# Altium schematic sheet Power_Switch.SchDoc: Dahlia Carrier Board
size A3; Organization: Toradex AG; Address1: Ebenaustrasse 10; Address2: Horw; Address3: 6048; Address4: Switzerland; DocumentNumber: 4; Revision: V1.1; SheetNumber: 4; SheetTotal: 21; PageSetup: Record=PageOptions|CenterHorizontal=True|CenterVertical=True|PrintScale=0.71|XCorrection=1.00|YCorrection=1.00|PrintKind=1|BorderSize=5000000|LeftOffset=0|BottomOffset=0|Orientation=2|PaperLength=1000|PaperWidth=1000|Scale=100|PaperSource=15|PrintQuality=600|MediaType=1|DitherType=10|PaperKind=A4|PrintScaleMode=1
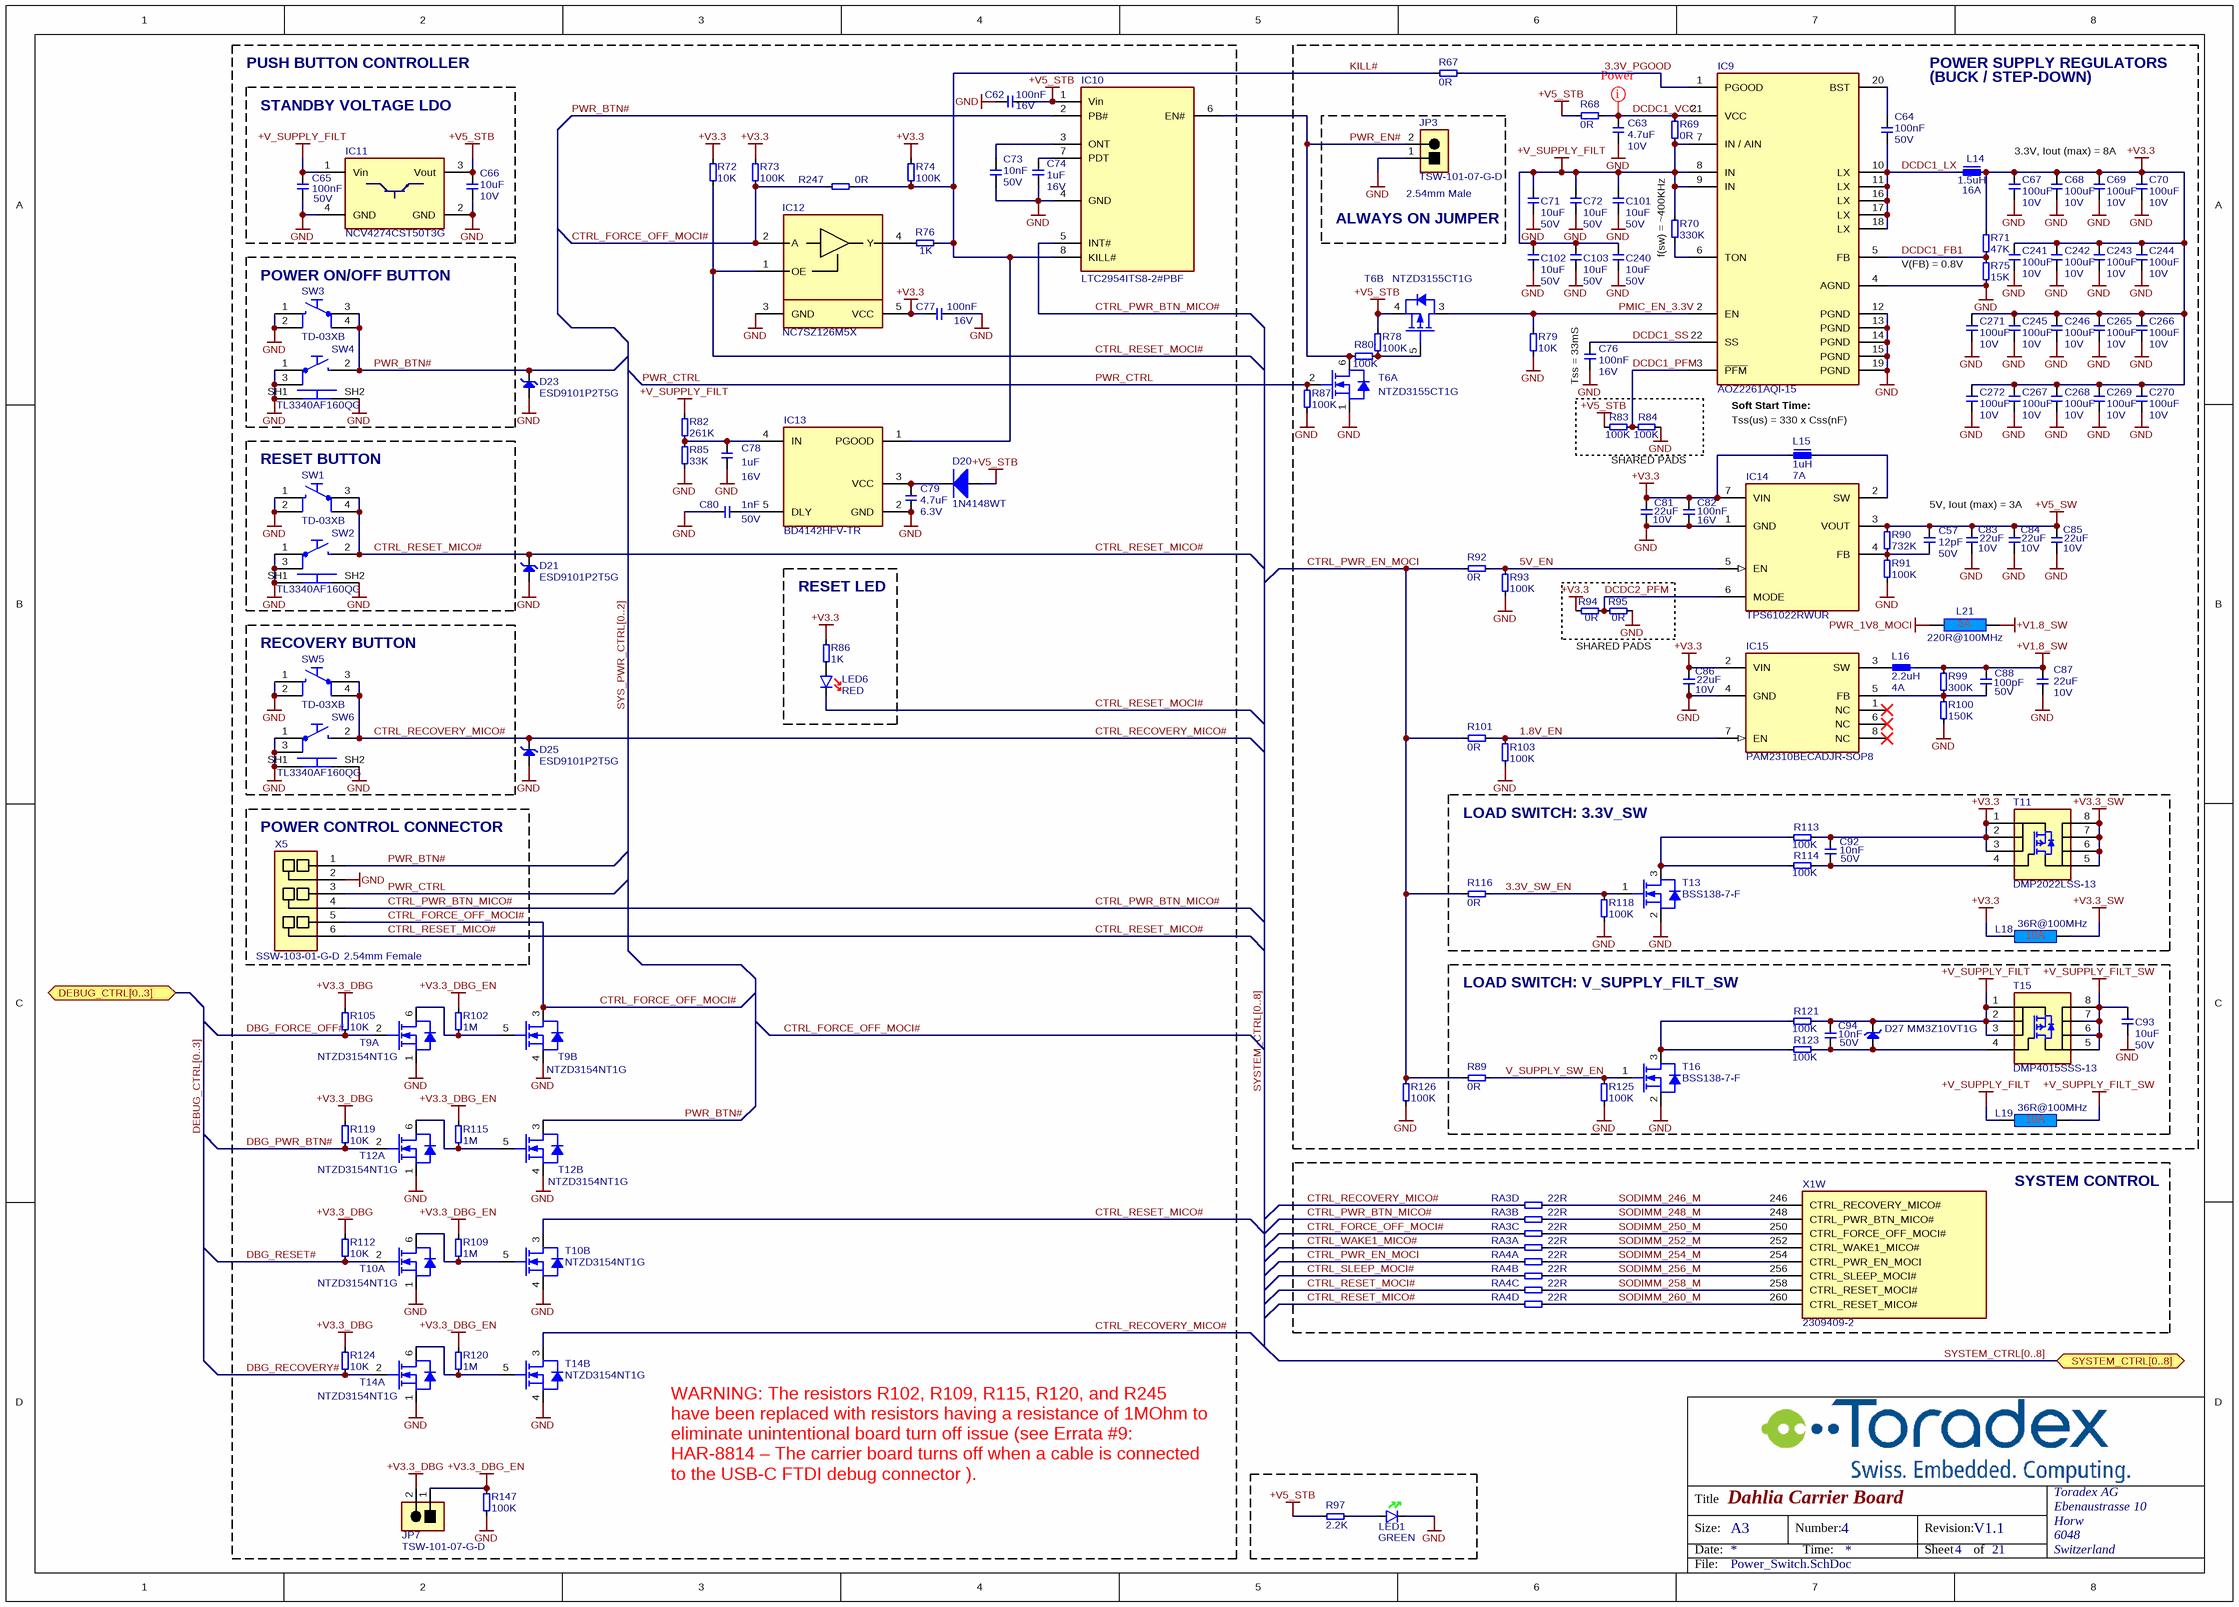
[diagram p0: Power_Switch.SchDoc]

## Parts
C57  Rating: 50V  [CAPC1005X60N]  (hidden comment: 12pF)
C62  Rating: 16V  [CAPC1005X60N]  (hidden comment: 100nF)
C63  Rating: 10V  [T_CAPC0603X33N]  (hidden comment: 4.7uF)
C64  Rating: 50V  [CAPC1005X60N]  (hidden comment: 100nF)
C65  Rating: 50V  [CAPC1005X60N]  (hidden comment: 100nF)
C66  Rating: 10V  [T_CAPC0603X33N]  (hidden comment: 10uF)
C67  Rating: 10V  [T_CAPC1206X60N]  (hidden comment: 100uF)
C68  Rating: 10V  [T_CAPC1206X60N]  (hidden comment: 100uF)
C69  Rating: 10V  [T_CAPC1206X60N]  (hidden comment: 100uF)
C70  Rating: 10V  [T_CAPC1206X60N]  (hidden comment: 100uF)
C71  Rating: 50V  [T_CAPC1206X60N]  (hidden comment: 10uF)
C72  Rating: 50V  [T_CAPC1206X60N]  (hidden comment: 10uF)
C73  Rating: 50V  [CAPC1005X60N]  (hidden comment: 10nF)
C74  Rating: 16V  [CAPC1005X60N]  (hidden comment: 1uF)
C76  Rating: 16V  [CAPC1005X60N]  (hidden comment: 100nF)
C77  Rating: 16V  [CAPC1005X60N]  (hidden comment: 100nF)
C78  Rating: 16V  [CAPC1005X60N]  (hidden comment: 1uF)
C79  Rating: 6.3V  [CAPC1005X60N]  (hidden comment: 4.7uF)
C80  Rating: 50V  [CAPC1005X60N]  (hidden comment: 1nF)
C81  Rating: 10V  [T_CAPC0805X125N]  (hidden comment: 22uF)
C82  Rating: 16V  [CAPC1005X60N]  (hidden comment: 100nF)
C83  Rating: 10V  [T_CAPC0805X125N]  (hidden comment: 22uF)
C84  Rating: 10V  [T_CAPC0805X125N]  (hidden comment: 22uF)
C85  Rating: 10V  [T_CAPC0805X125N]  (hidden comment: 22uF)
C86  Rating: 10V  [T_CAPC0805X125N]  (hidden comment: 22uF)
C87  Rating: 10V  [T_CAPC0805X125N]  (hidden comment: 22uF)
C88  Rating: 50V  [CAPC1005X60N]  (hidden comment: 100pF)
C92  Rating: 50V  [CAPC1005X60N]  (hidden comment: 10nF)
C93  Rating: 50V  [T_CAPC1206X60N]  (hidden comment: 10uF)
C94  Rating: 50V  [CAPC1005X60N]  (hidden comment: 10nF)
C101  Rating: 50V  [T_CAPC1206X60N]  (hidden comment: 10uF)
C102  Rating: 50V  [T_CAPC1206X60N]  (hidden comment: 10uF)
C103  Rating: 50V  [T_CAPC1206X60N]  (hidden comment: 10uF)
C240  Rating: 50V  [T_CAPC1206X60N]  (hidden comment: 10uF)
C241  Rating: 10V  [T_CAPC1206X60N]  (hidden comment: 100uF)
C242  Rating: 10V  [T_CAPC1206X60N]  (hidden comment: 100uF)
C243  Rating: 10V  [T_CAPC1206X60N]  (hidden comment: 100uF)
C244  Rating: 10V  [T_CAPC1206X60N]  (hidden comment: 100uF)
C245  Rating: 10V  [T_CAPC1206X60N]  (hidden comment: 100uF)
C246  Rating: 10V  [T_CAPC1206X60N]  (hidden comment: 100uF)
C265  Rating: 10V  [T_CAPC1206X60N]  (hidden comment: 100uF)
C266  Rating: 10V  [T_CAPC1206X60N]  (hidden comment: 100uF)
C267  Rating: 10V  [T_CAPC1206X60N]  (hidden comment: 100uF)
C268  Rating: 10V  [T_CAPC1206X60N]  (hidden comment: 100uF)
C269  Rating: 10V  [T_CAPC1206X60N]  (hidden comment: 100uF)
C270  Rating: 10V  [T_CAPC1206X60N]  (hidden comment: 100uF)
C271  Rating: 10V  [T_CAPC1206X60N]  (hidden comment: 100uF)
C272  Rating: 10V  [T_CAPC1206X60N]  (hidden comment: 100uF)
D20  1N4148WT  [SOD-523F]
D21  ESD9101P2T5G  [SOD-923]
D23  ESD9101P2T5G  [SOD-923]
D25  ESD9101P2T5G  [SOD-923]
D27  MM3Z10VT1G  [T_SOD-323]
IC9  AOZ2261AQI-15  [T_QFN50P400X400X100-22N]
IC10  LTC2954ITS8-2#PBF  [T_LINEAR_LTC2954CTS8-2#PBF]
IC11  NCV4274CST50T3G  [T_ON_NCV4264-2ST50T3G]
IC12  NC7SZ126M5X  [SOT95P279X142-5N]
IC13  BD4142HFV-TR  [IC-Rohm-BD4142HFV-TR]
IC14  TPS61022RWUR  [T_TI_TPS61022RWUR]
IC15  Manufacturer Part No.: PAM2310BECADJR-SOP8  [IC-SO-8EP]  (hidden comment: PAM2310BECADJR)
JP3  TSW-101-07-G-D  [T_Samtec_TSW-101-07-G-D]
JP7  TSW-101-07-G-D  [T_Samtec_TSW-101-07-G-D]
L14  Rating: 16A  [T_INDM110100]  (hidden comment: 1.5uH)
L15  Rating: 7A  [T_INDM_PA4340]  (hidden comment: 1uH)
L16  Rating: 4A  [IND-BOURNS-SRP4020TA]  (hidden comment: 2.2uH)
L18  36R@100MHz  [T_Laird_35F0121-0SR-10]
L19  36R@100MHz  [T_Laird_35F0121-0SR-10]
L21  220R@100MHz  [INDC1608X95N]
LED1  Color: GREEN  [T_Liteon_LTST-C190GKT]  (hidden comment: LTST-C190GKT)
LED6  Color: RED  [T_Liteon_LTST-C190KRKT]  (hidden comment: LTST-C190KRKT)
R67  0R  [T_RESC0603X30N]
R68  0R  [T_RESC0603X30N]
R69  0R  [T_RESC0603X30N]
R70  330K  [RESC1005X40N]
R71  47K  [RESC1005X40N]
R72  10K  [RESC1005X40N]
R73  100K  [RESC1005X40N]
R74  100K  [RESC1005X40N]
R75  15K  [RESC1005X40N]
R76  1K  [RESC1005X40N]
R78  100K  [RESC1005X40N]
R79  10K  [RESC1005X40N]
R80  100K  [RESC1005X40N]
R82  261K  [RESC1005X40N]
R83  100K  [T_RESC0603X30N]
R84  100K  [T_RESC0603X30N]
R85  33K  [RESC1005X40N]
R86  1K  [RESC1005X40N]
R87  100K  [RESC1005X40N]
R89  0R  [T_RESC0603X30N]
R90  732K  [RESC1005X40N]
R91  100K  [RESC1005X40N]
R92  0R  [T_RESC0603X30N]
R93  100K  [RESC1005X40N]
R94  0R  [T_RESC0603X30N]
R95  0R  [T_RESC0603X30N]
R97  2.2K  [RESC1005X40N]
R99  300K  [RESC1005X40N]
R100  150K  [RESC1005X40N]
R101  0R  [T_RESC0603X30N]
R102  1M  [RESC1005X40N]
R103  100K  [RESC1005X40N]
R105  10K  [RESC1005X40N]
R109  1M  [RESC1005X40N]
R112  10K  [RESC1005X40N]
R113  100K  [RESC1005X40N]
R114  100K  [RESC1005X40N]
R115  1M  [RESC1005X40N]
R116  0R  [T_RESC0603X30N]
R118  100K  [RESC1005X40N]
R119  10K  [RESC1005X40N]
R120  1M  [RESC1005X40N]
R121  100K  [RESC1005X40N]
R123  100K  [RESC1005X40N]
R124  10K  [RESC1005X40N]
R125  100K  [RESC1005X40N]
R126  100K  [RESC1005X40N]
R147  100K  [RESC1005X40N]
R247  0R  [T_RESC0603X30N]
RA3  22R  [T_Resistor_Array_X4]  (parts A,B,C,D of 4)
RA4  22R  [T_Resistor_Array_X4]  (parts A,B,C,D of 4)
SW1  TD-03XB  [T_WMF_TD-03XB]
SW2  TL3340AF160QG  [T_E-SWITCH- TL3340AF160QG]
SW3  TD-03XB  [T_WMF_TD-03XB]
SW4  TL3340AF160QG  [T_E-SWITCH- TL3340AF160QG]
SW5  TD-03XB  [T_WMF_TD-03XB]
SW6  TL3340AF160QG  [T_E-SWITCH- TL3340AF160QG]
T6  NTZD3155CT1G  [SOTFL50P160X60-6N]  (parts A,B of 2)
T9  Manufacturer Part No.: NTZD3154NT1G  [SOTFL50P160X60-6N]  (hidden comment: T-ONSemi-NTZD3154NT1G)  (parts A,B of 2)
T10  Manufacturer Part No.: NTZD3154NT1G  [SOTFL50P160X60-6N]  (hidden comment: T-ONSemi-NTZD3154NT1G)  (parts A,B of 2)
T11  DMP2022LSS-13  [SOIC127P600X173-8N]
T12  Manufacturer Part No.: NTZD3154NT1G  [SOTFL50P160X60-6N]  (hidden comment: T-ONSemi-NTZD3154NT1G)  (parts A,B of 2)
T13  BSS138-7-F  [SOT95P237X112-3N]
T14  Manufacturer Part No.: NTZD3154NT1G  [SOTFL50P160X60-6N]  (hidden comment: T-ONSemi-NTZD3154NT1G)  (parts A,B of 2)
T15  DMP4015SSS-13  [SOIC127P600X173-8N]
T16  BSS138-7-F  [SOT95P237X112-3N]
X1  2309409-2  [CON-TE-2309409-2-SOLDERABLE-STANDOFFS]  (part W of 23)
X5  Manufacturer Part No.: SSW-103-01-G-D  [T_Samtec_SSW-103-01-G-D]  (hidden comment: TSW-103-01-G-D)

## Blocks framed on the sheet
ALWAYS ON JUMPER: JP3
POWER ON/OFF BUTTON: SW3 SW4
Tss = 33mS: R83 R84
RESET BUTTON: SW1 SW2
RESET LED: LED6 R86
RECOVERY BUTTON: SW5 SW6
POWER CONTROL CONNECTOR: X5
LOAD SWITCH: 3.3V_SW: C92 L18 R113 R114 R116 R118 T11 T13
LOAD SWITCH: V_SUPPLY_FILT_SW: C93 C94 D27 L19 R89 R121 R123 R125 T15 T16
SYSTEM CONTROL: RA3 RA4 X1

## Ports
DEBUG_CTRL[0..3] (bidir), SYSTEM_CTRL[0..8] (bidir)

## Nets
+V1.8_SW: C87.2 C88.2 L16.2 L21.2 R99.2
+V3.3: C67.2 C68.2 C69.2 C70.2 C77.1 C81.2 C82.2 C86.2 C92.2 C241.2 C242.2 C243.2 C244.2 C245.2 C246.2 C265.2 C266.2 C267.2 C268.2 C269.2 C270.2 C271.2 C272.2 IC12.5(VCC) IC14.7(VIN) IC15.2(VIN) L14.2 L15.1 L18.1 R71.2 R72.2 R73.2 R74.2 R86.2 R94.1 R113.2 T11.1(S) T11.2(S) T11.3(S)
+V3.3_DBG: JP7.2 R105.2 R112.2 R119.2 R124.2
+V3.3_DBG_EN: JP7.1 R102.2 R109.2 R115.2 R120.2 R147.2
+V3.3_SW: L18.2 T11.5(D) T11.6(D) T11.7(D) T11.8(D)
+V5_STB: C62.2 C66.2 D20.A IC10.1(Vin) IC11.3(Vout) R68.1 R78.1 R83.1 R97.2 T6.4(S)
+V5_SW: C57.1 C83.2 C84.2 C85.2 IC14.3(VOUT) R90.2
+V_SUPPLY_FILT: C65.2 C71.2 C72.2 C94.2 C101.2 C102.2 C103.2 C240.2 D27.1(C) IC9.7(IN_/_AIN) IC9.8(IN) IC9.9(IN) IC11.1(Vin) L19.1 R69.2 R70.2 R82.2 R121.2 T15.1(S) T15.2(S) T15.3(S)
+V_SUPPLY_FILT_SW: C93.2 L19.2 T15.5(D) T15.6(D) T15.7(D) T15.8(D)
GND: C62.1 C63.1 C65.1 C66.1 C67.1 C68.1 C69.1 C70.1 C71.1 C72.1 C73.1 C74.1 C76.1 C77.2 C78.1 C79.1 C80.1 C81.1 C82.1 C83.1 C84.1 C85.1 C86.1 C87.1 C93.1 C101.1 C102.1 C103.1 C240.1 C241.1 C242.1 C243.1 C244.1 C245.1 C246.1 C265.1 C266.1 C267.1 C268.1 C269.1 C270.1 C271.1 C272.1 D21.2(A) D23.2(A) D25.2(A) IC9.4(AGND) IC9.12(PGND) IC9.13(PGND) IC9.14(PGND) IC9.15(PGND) IC9.19(PGND) IC10.4(GND) IC11.2(GND) IC11.4(GND) IC12.3(GND) IC13.2(GND) IC14.1(GND) IC15.4(GND) JP3.1 LED1.K R75.1 R79.1 R84.2 R85.1 R87.1 R91.1 R93.1 R95.2 R100.1 R103.1 R118.1 R125.1 R126.1 R147.1 SW1.1 SW1.2 SW2.1 SW2.3 SW2.SH1 SW2.SH2 SW3.1 SW3.2 SW4.1 SW4.3 SW4.SH1 SW4.SH2 SW5.1 SW5.2 SW6.1 SW6.3 SW6.SH1 SW6.SH2 T6.1(S) T9.1(S) T9.4(S) T10.1(S) T10.4(S) T12.1(S) T12.4(S) T13.2(S) T14.1(S) T14.4(S) T16.2(S) X5.2
PWR_1V8_MOCI: L21.1
1.8V_EN: IC15.7(EN) R101.2 R103.2
3.3V_PGOOD: IC9.1(PGOOD) R67.2
3.3V_SW_EN: R116.2 R118.2 T13.1(G)
5V_EN: IC14.5(EN) R92.2 R93.2
CTRL_FORCE_OFF_MOCI#: IC12.2(A) R73.1 R247.1 RA3.7 T9.3(D) X5.5
CTRL_PWR_BTN_MICO#: IC10.5(INT#) RA3.6 X5.4
CTRL_PWR_EN_MOCI: R89.1 R92.1 R101.1 R116.1 R126.2 RA4.5
CTRL_RECOVERY_MICO#: D25.1(C) RA3.8 SW5.3 SW5.4 SW6.2 T14.3(D)
CTRL_RESET_MICO#: D21.1(C) RA4.8 SW1.3 SW1.4 SW2.2 T10.3(D) X5.6
CTRL_RESET_MOCI#: IC12.1(OE) LED6.K R72.1 RA4.7
CTRL_SLEEP_MOCI#: RA4.6
CTRL_WAKE1_MICO#: RA3.5
DBG_FORCE_OFF#: R105.1 T9.2(G)
DBG_PWR_BTN#: R119.1 T12.2(G)
DBG_RECOVERY#: R124.1 T14.2(G)
DBG_RESET#: R112.1 T10.2(G)
DCDC1_FB1: IC9.5(FB) R71.1 R75.2
DCDC1_LX: C64.1 IC9.10(LX) IC9.11(LX) IC9.16(LX) IC9.17(LX) IC9.18(LX) L14.1
DCDC1_PFM: IC9.3(~{PFM}) R83.2 R84.1
DCDC1_SS: C76.2 IC9.22(SS)
DCDC1_VCC: C63.2 IC9.21(VCC) R68.2 R69.1
DCDC2_PFM: IC14.6(MODE) R94.2 R95.1
KILL#: IC10.8(KILL#) IC13.1(PGOOD) R67.1 R74.1 R76.2 R247.2
PMIC_EN_3.3V: IC9.2(EN) R79.2 T6.3(D)
PWR_BTN#: D23.1(C) IC10.2(PB#) SW3.3 SW3.4 SW4.2 T12.3(D) X5.1
PWR_CTRL: R87.2 T6.2(G) X5.3
PWR_EN#: IC10.6(EN#) JP3.2 R80.1 T6.6(D)
SODIMM_246_M: RA3.4 X1.246(CTRL_RECOVERY_MICO#)
SODIMM_248_M: RA3.2 X1.248(CTRL_PWR_BTN_MICO#)
SODIMM_250_M: RA3.3 X1.250(CTRL_FORCE_OFF_MOCI#)
SODIMM_252_M: RA3.1 X1.252(CTRL_WAKE1_MICO#)
SODIMM_254_M: RA4.1 X1.254(CTRL_PWR_EN_MOCI)
SODIMM_256_M: RA4.2 X1.256(CTRL_SLEEP_MOCI#)
SODIMM_258_M: RA4.3 X1.258(CTRL_RESET_MOCI#)
SODIMM_260_M: RA4.4 X1.260(CTRL_RESET_MICO#)
V_SUPPLY_SW_EN: R89.2 R125.2 T16.1(G)
NetC57_2: C57.2 IC14.4(FB) R90.1 R91.2
NetC64_2: C64.2 IC9.20(BST)
NetC73_2: C73.2 IC10.3(ONT)
NetC74_2: C74.2 IC10.7(PDT)
NetC78_2: C78.2 IC13.4(IN) R82.1 R85.2
NetC79_2: C79.2 D20.C IC13.3(VCC)
NetC80_2: C80.2 IC13.5(DLY)
NetC88_1: C88.1 IC15.5(FB) R99.1 R100.2
NetC92_1: C92.1 R114.2 T11.4(G)
NetC94_1: C94.1 D27.2(A) R123.2 T15.4(G)
NetIC9_6: IC9.6(TON) R70.1
NetIC12_4: IC12.4(Y) R76.1
NetIC14_2: IC14.2(SW) L15.2
NetIC15_3: IC15.3(SW) L16.1
NetLED1_A: LED1.A R97.1
NetLED6_A: LED6.A R86.1
NetR78_2: R78.2 R80.2 T6.5(G)
NetR102_1: R102.1 T9.5(G) T9.6(D)
NetR109_1: R109.1 T10.5(G) T10.6(D)
NetR113_1: R113.1 R114.1 T13.3(D)
NetR115_1: R115.1 T12.5(G) T12.6(D)
NetR120_1: R120.1 T14.5(G) T14.6(D)
NetR121_1: R121.1 R123.1 T16.3(D)

Not connected (* = marked no-connect by the designer): IC15 1(NC)* 6(NC)* 8(NC)*

## Buses and harness runs
bus DEBUG_CTRL[0..3] = port DEBUG_CTRL[0..3]
bus SYS_PWR_CTRL[0..2]
bus SYSTEM_CTRL[0..8] = port SYSTEM_CTRL[0..8]

## Layout directives
net class Power: DCDC1_VCC

## Notes on the sheet
- PUSH BUTTON CONTROLLER
- STANDBY VOLTAGE LDO
- POWER SUPPLY REGULATORS
- (BUCK / STEP-DOWN)
- 3.3V, Iout (max) = 8A
- (near JP3) 2.54mm Male
- (near R70) f(sw) = ~400KHz
- V(FB) = 0.8V
- Soft Start Time:
- SHARED PADS
- Tss(us) = 330 x Css(nF)
- 5V, Iout (max) = 3A
- 2.54mm Female
- WARNING: The resistors R102, R109, R115, R120, and R245 have been replaced with resistors having a resistance of 1MOhm to eliminate unintentional board turn off issue (see Errata #9: HAR-8814 – The carrier board turns off when a cable is connected to the USB-C FTDI debug connector ).
- Title
- Size:
- Date:
- A3
- Number:
- Time:
- Revision:
- Sheet
- of
- File:

## Library data of the parts
C57 = C-NP0-12p-50V-5%-0402: Capacitor Ceramic NP0  12pF 50V 5% 0402; Tolerance: 5%; Type: NP0; Value: 12pF
C62 C76 C77 C82 = C-X7R-100nF-16V-10%-0402: Capacitor Ceramic X7R 100nF 16V 10% 0402; Tolerance: 10%; Type: X7R; Value: 100nF
C63 = C-X5R-4.7uF-10V-10%-0603: Capacitor Ceramic X5R 4.7uF 10V 10% 0603; Tolerance: 10%; Type: X5R; Value: 4.7uF
C64 C65 = C-X7R-100nF-50V-10%-0402: Capacitor Ceramic X7R 100nF 50V 10% 0402; Tolerance: 10%; Type: X7R; Value: 100nF
C66 = C-X5R-10uF-10V-20%-0603: Capacitor Ceramic X5R 10uF 10V 20% 0603; Tolerance: 20%; Type: X5R; Value: 10uF
C67-C70 C241-C246 C265-C272 = C-X5R-100uF-10V-20%-1206: Capacitor Ceramic X5R 100uF 10V 20% 1206; Tolerance: 20%; Type: X5R; Value: 100uF
C71 C72 C93 C101-C103 C240 = C-X5R-10uF-50V-20%-1206: Capacitor Ceramic X5R 10uF 50V 20% 1206; Tolerance: 20%; Type: X5R; Value: 10uF
C73 C92 C94 = C-X7R-10nF-50V-10%-0402: Capacitor Ceramic X7R 10nF 50V 10% 0402; Tolerance: 10%; Type: X7R; Value: 10nF
C74 C78 = C-X5R-1uF-16V-20%-0402: Capacitor Ceramic X5R 1uF 16V 20% 0402; Tolerance: 20%; Type: X5R; Value: 1uF
C79 = C-X5R-4.7u-6.3V-20%-0402: Capacitor Ceramic X5R 4.7uF 6.3V 20% 0402; Tolerance: 20%; Type: X5R; Value: 4.7uF
C80 = C-X7R-1nF-50V-10%-0402: Capacitor Ceramic X7R 1nF 50V 10% 0402; Tolerance: 10%; Type: X7R; Value: 1nF
C81 C83-C87 = C-X5R-22uF-10V-20%-0805: Capacitor Ceramic X5R 22uF 10V 20% 0805; Tolerance: 20%; Type: X5R; Value: 22uF; ClassName: Power_Poly
C88 = C-X7R-100pF-50V-10%-0402: Capacitor Ceramic X7R 100pF 50V 10% 0402; Tolerance: 10%; Type: X7R; Value: 100pF
D20 = D-OnSemi-1N4148WT: Diode Standard 75V 200mA Surface Mount SOD-523F; Manufacturer Name: On Semi; Manufacturer Part No.: 1N4148WT
D21 D23 D25 = D-OnSemi-ESD9101P2T5G: ESD Protection Diode; Manufacturer Name: OnSemi; Manufacturer Part No.: ESD9101P2T5G
D27 = D-OnSemi-MM3Z10VT1G: DIODE ZENER 10V 300MW SOD323; Manufacturer Name: OnSemi; Manufacturer Part No.: MM3Z10VT1G
IC9 = IC-A&O-AOZ2261AQI-15: 8A (Iout(max)) Synchronous Buck Regulator, QFN-22L (4mmx 4mm), Vin = 4V to 28V; Manufacturer Name: Alpha and Omega; Manufacturer Part No.: AOZ2261AQI-15
IC10 = IC-LIN-LTC2954ITS8-2#PBF: Push Button On/Off Controller; Manufacturer Name: Linear; Package: *; Temperature Range: -40 +85; Manufacturer Part No.: LTC2954ITS8-2#PBF
IC11 = IC-ON-NCV4274CST50T3G: LDO regulator, Vout = 5V, Iout(max) = 0.4A, Vin = 5.5V to 40V, SOT-223; Manufacturer Name: ON Semiconductor; Manufacturer Part No.: NCV4274CST50T3G
IC12 = IC-FAR-NC7SZ126M5X: NC7SZ126M5X  Buffer Three-State Output; Manufacturer Name: Fairchild Semiconductor; Manufacturer Part No.: NC7SZ126M5X
IC13 = IC-Rohm-BD4142HFV-TR: Supervisor Open Drain or Open Collector 1 Channel HVSOF5; Manufacturer Name: Rohm; Manufacturer Part No.: BD4142HFV-TR
IC14 = IC-TI-TPS61022RWUR: Integrated Boost Regulator; Manufacturer Name: Texas Instruments; Manufacturer Part No.: TPS61022RWUR
IC15 = IC-DIODES-PAM2310BECADJR-SOP8: Integrated Buck Regulator; Manufacturer Name: Diodes
JP3 JP7 = CON-Samtec-TSW-101-07-G-D: Header male, 1x2 Pins, 2.54 mm pitch; Manufacturer Name: Samtec; Pitch: 2.54 mm; No. of ways: 1x2; Manufacturer Part no.: TSW-101-07-G-D
L14 = L-Pulse-PA4342.152NLT-1.5uH-16A-20%: Inductance 1.5uH, 20%, Irms=16A, Isat=33A, DCR=4.6 mOhm; Manufacturer Name: Pulse; I (saturation): 33A; Tolerance: 20%; Manufacturer Part No.: PA4342.152NLT; I (RMS): 16A; Value: 1.5uH; ClassName: Power_Poly
L15 = L-Pulse-PA4340.102NLT-1uH-7A-20%: Inductance 1uH, 20%, Irms=7A, Isat=11A, DCR=14 mOhm; Manufacturer Name: Pulse; I (saturation): 11A; Tolerance: 20%; Manufacturer Part No.: PA4340.102NLT; I (RMS): 7A; Value: 1uH
L16 = L-Bourns-SRP4020TA-2R2M-2.2uH-4A-20%: 2.2µH Shielded Wirewound Inductor 4A 61mOhm Max 2-SMD; Manufacturer Name: Bourns; Tolerance: 20%; I (saturation): 6A; Manufacturer Part No.: SRP4020TA-2R2M; I (RMS): 4A; Value: 2.2uH; ClassName: Power_Poly
L18 L19 = L-Laird-35F0121-0SR-10-10A-25%: Power Supply FB 10A; Tolerance: 25%; Rating: 10A; Value: 36R@100MHz; ClassName: Power_Poly
L21 = L-220R@100MHz-2A-25%-0603: 220R@100MHz 2A EMI FILTER; Tolerance: 25%; Rating: 2A; Value: 220R@100MHz
LED1 = LED-LiteOn-LTST-C190GKT: LED green Lite-ON LTST-C190GKT; Manufacturer Name: Lite-ON; Manufacturer Part No.: LTST-C190GKT
LED6 = LED-LiteOn-LTST-C190KRKT: LED red, Lite-On LTST-C190KRKT; Manufacturer Part No.: LTST-C190KRKT; Manufacturer Name: Lite-On
R67-R69 R89 R92 R94 R95 R101 R116 R247 = R-0R-63mW-1%-0603: Resistor 0 ohm 63mW 1% 0603; Rating: 63mW; Tolerance: 1%; Value: 0R
R70 = R-330KR-63mW-1%-0402: Resistor 330 Kohm 63mW 1% 0402; Value: 330KR; Rating: 63mW; Tolerance: 1%
R71 = R-47K-63mW-1%-0402: Resistor 47 Kohm 63mW 1% 0402; Rating: 63mW; Tolerance: 1%; Value: 47K
R72 R79 R105 R112 R119 R124 = R-10K-63mW-5%-0402: Resistor 10 Kohm 63mW 5% 0402; Rating: 63mW; Tolerance: 5%; Value: 10K
R73 R74 R78 R80 R87 R93 R103 R113 R114 R118 R121 R123 R125 R126 R147 = R-100K-63mW-5%-0402: Resistor 100 Kohm 63mW 5% 0402; Rating: 63mW; Tolerance: 5%; Value: 100K
R75 = R-15KR-63mW-1%-0402: Resistor 15 Kohm 63mW 1% 0402; Value: 15KR; Rating: 63mW; Tolerance: 1%
R76 R86 = R-1K-63mW-5%-0402: Resistor 1 Kohm 63mW 5% 0402; Rating: 63mW; Tolerance: 5%; Value: 1K
R82 = R-261K-63mW-1%-0402: Resistor 261 Kohm 63mW 1% 0402; Rating: 63mW; Tolerance: 1%; Value: 261K
R83 R84 = R-100K-63mW-5%-0603: Resistor 100 Kohm 63mW 5% 0603; Rating: 63mW; Tolerance: 5%; Value: 100K
R85 = R-33K-63mW-1%-0402: Resistor 33 Kohm 63mW 1% 0402; Rating: 63mW; Tolerance: 1%; Value: 33K
R90 = R-732K-63mW-1%-0402: Resistor 732 Kohm 63mW 1% 0402; Rating: 63mW; Tolerance: 1%; Value: 732K
R91 = R-100K-63mW-1%-0402: Resistor 100 Kohm 63mW 1% 0402; Rating: 63mW; Tolerance: 1%; Value: 100K
R97 = R-2.2K-63mW-5%-0402: Resistor 2.2 Kohm 63mW 5% 0402; Value: 2.2KR; Rating: 63mW; Tolerance: 5%
R99 = R-300K-63mW-1%-0402: Resistor 300 Kohm 63mW 1% 0402; Rating: 63mW; Tolerance: 1%; Value: 300K
R100 = R-150K-63mW-1%-0402: Resistor 150 Kohm 63mW 1% 0402; Value: 150KR; Rating: 63mW; Tolerance: 1%
R102 R109 R115 R120 = R-1M-63mW-5%-0402: Resistor 1 Mohm 63mW 5% 0402; Rating: 63mW; Tolerance: 5%; Value: 1M
RA3 RA4 = RA-22R-63mW-5%-1206-div: Resistor Array 22 R 63mW 5% 1206; Tolerance: 5%; Power Dissipation: 63mW; Value: 22R
SW1 SW3 SW5 = SW-WMF-TD-03XB: Push Button; Manufacturer Name: WMF; Manufacturer Part No.: TD-03XB-Z; Rating: 50mA
SW2 SW4 SW6 = SW-E-Switch-TL3340AF160QG: SWITCH TACT SUB MINI 160GF SMD Right Angle; Manufacturer Name: E-Switch; Manufacturer Part No.: TL3340AF160QG
T6 = T-ONSemi-NTZD3155CT1G: N- and P-Channel MOSFET 20V; Manufacturer Name: ONSemi; Manufacturer Part No.: NTZD3155CT1G
T9 T10 T12 T14 = T-ONSemi-NTZD3154NT1G: Dual N-Channel 20V (D-S)  MOSFET; Manufacturer Name: ONSemi
T11 = T-Diodes-DMP2022LSS-13-8-SOIC: p-channel MOSFET, DMP2022LSS-13; Manufacturer Name: DIODES; Manufacturer Part No.: DMP2022LSS-13; ClassName: Power_Poly
T13 T16 = T-Diodes-BSS138-7-F: N-channel MOSFET, BSS138-7-F; Manufacturer Name: Diodes; Manufacturer Part No.: BSS138-7-F
T15 = T-DiodesInc-DMP4015SSS-13: P-channel MOSFET, DMP4015SSS-13; Manufacturer Name: Diodes Inc; Manufacturer Part No.: DMP4015SSS-13; ClassName: Power_Poly
X1 = CON-TE-2309409-2: DDR4 SODIMM Socket, 260 pins, 5.2mm(H), 0.5mm Pitch; Manufacturer Name: TE; Temperature Range: -40C to +125C; Package: DDR4-SODIMM-260; Manufacturer Part No.: 2309409-2
X5 = CON-Samtec-SSW-103-01-G-D: Receptacle Female Socket, 2x3 Pins, 2.54mm pitch; Manufacturer Name: Samtec; No. of ways: 2x3; Pitch: 2.54mm